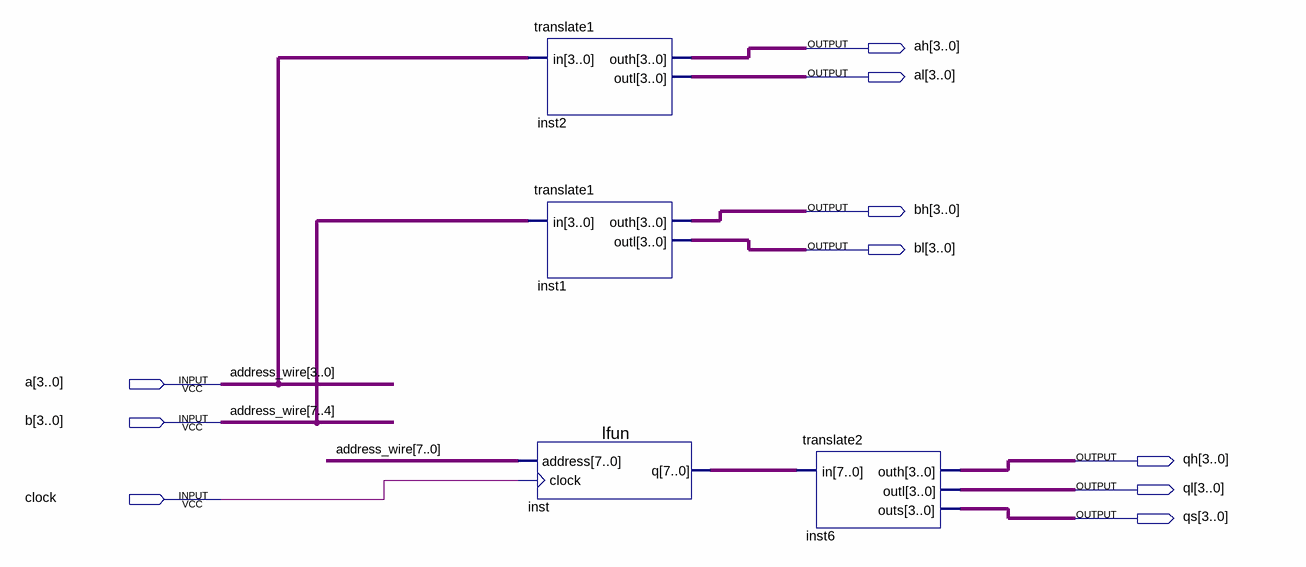
[diagram p0: schematic sheet]
// Quartus schematic Demo.bdf as structural Verilog: 4 symbols, 10 pins
module Demo (
  input  [3:0] a,
  input  [3:0] b,
  input  clock,
  output [3:0] ah,
  output [3:0] al,
  output [3:0] bh,
  output [3:0] bl,
  output [3:0] qh,
  output [3:0] ql,
  output [3:0] qs
);

  wire [7:0] inst_q;

  lfun inst (.address({b, a}), .clock(clock), .q(inst_q));
  translate1 inst2 (.in(a), .outh(ah), .outl(al));
  translate1 inst1 (.in(b), .outh(bh), .outl(bl));
  translate2 inst6 (.in(inst_q), .outh(qh), .outl(ql), .outs(qs));

  // Other names for the same wires on the sheet: address_wire[7:0] = {b, a}
endmodule
